# EAGLE design initial-commit-01 (EAGLE 9.2.2)
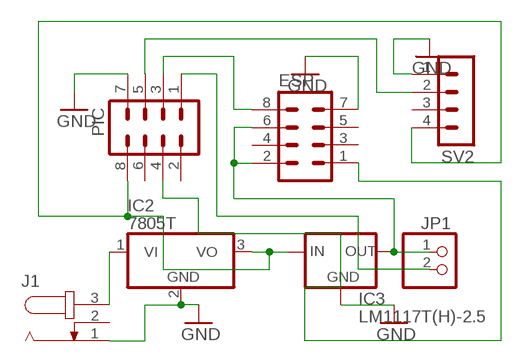
[diagram p0: schematic, sheet 1]

## Parts
ESP  MA04-2  [MA04-2]
IC2  7805T  [TO220H]
IC3  LM1117T(H)-2.5  [TO220H]
J1  JACK-PLUG1  [SPC4078]
JP1  PINHD-1X2  [1X02]
PIC  MA04-2  [MA04-2]
SV2  MA04-1  [MA04-1]

## Nets
GND: ESP.7 IC2.2(GND) IC3.1(GND) J1.1 PIC.7 SV2.1
N$1: IC2.1(VI) J1.3
N$2: ESP.1 PIC.4
N$4: ESP.2 ESP.6 IC3.2(OUT) JP1.1
N$5: ESP.8 PIC.3
N$7: JP1.2 PIC.1
N$8: PIC.5 SV2.2
N$9: IC2.3(VO) IC3.3(IN) PIC.8 SV2.4
Unconnected: ESP.3 ESP.4 ESP.5 J1.2 PIC.2 PIC.6 SV2.3

## Library data of the parts
ESP PIC = con-lstb:MA04-2: PIN HEADER; OC_FARNELL: unknown; OC_NEWARK: unknown
IC2 = linear:78*: Positive VOLTAGE REGULATOR Source: http://cache.national.com/ds/LM/LM78L05.pdf http://www.fairchildsemi.com/ds/LM/LM7805.pdf
IC3 = lm1117_10:LM1117?-*: 800mA Low-Dropout Linear Regulator Source: http://www.ti.com/lit/ds/symlink/lm1117-n.pdf; MF: Texas Instruments; MPN: LM1117T-2.5; OC_FARNELL: 1798354; OC_NEWARK: 75R2090
J1 = con-jack:JACK-PLUG: DC POWER JACK Power Jack, DC, Right Angle, Through Hole, Rated 5A at 16VDC, PC Terminals Distributor: Farnell (www.Farnell.de) Drawing: 84N1161.pdf / 84N1162.pdf Manufacturer: SPC Technology (www.spctechnology.com) Type: SPC4077 / SPC 4078; OC_FARNELL: unknown; OC_NEWARK: unknown
JP1 = pinhead:PINHD-1X2: PIN HEADER
SV2 = con-lstb:MA04-1: PIN HEADER; OC_FARNELL: unknown; OC_NEWARK: unknown

## Net classes
0 default: width 0.254 mm, clearance 0.254 mm

## Board
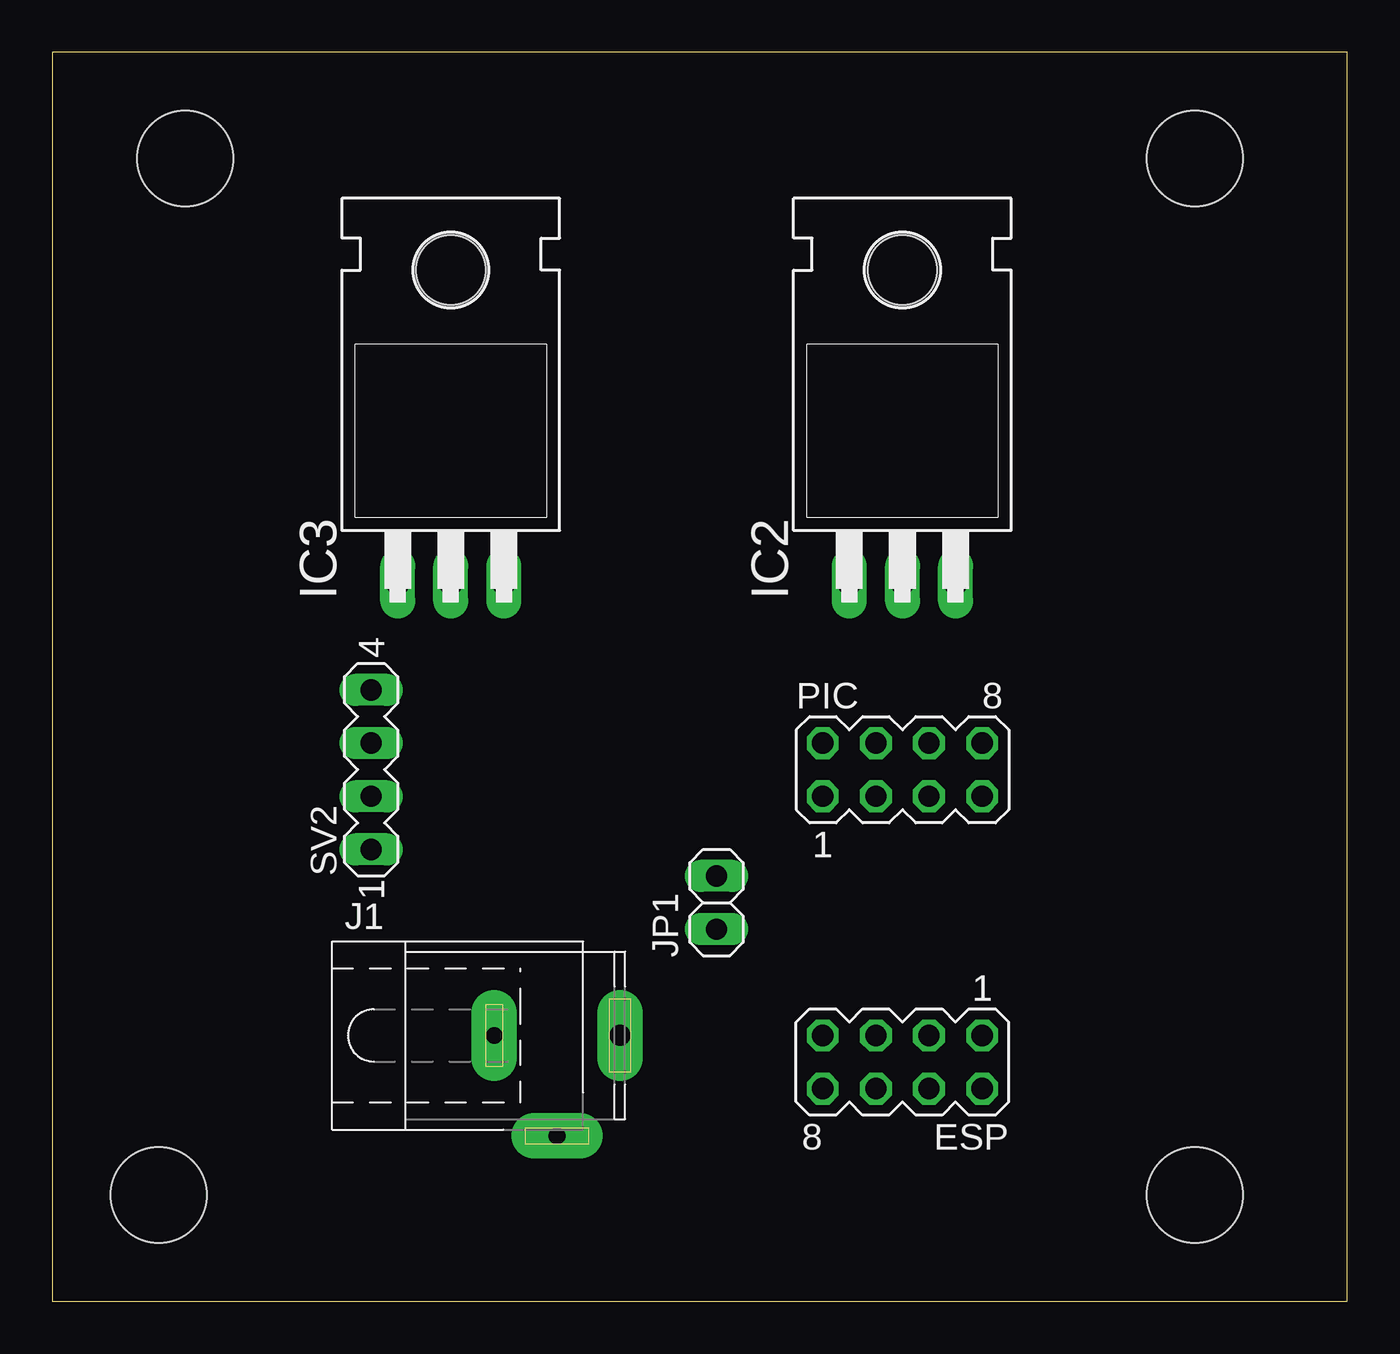
[diagram p1: board, top side]
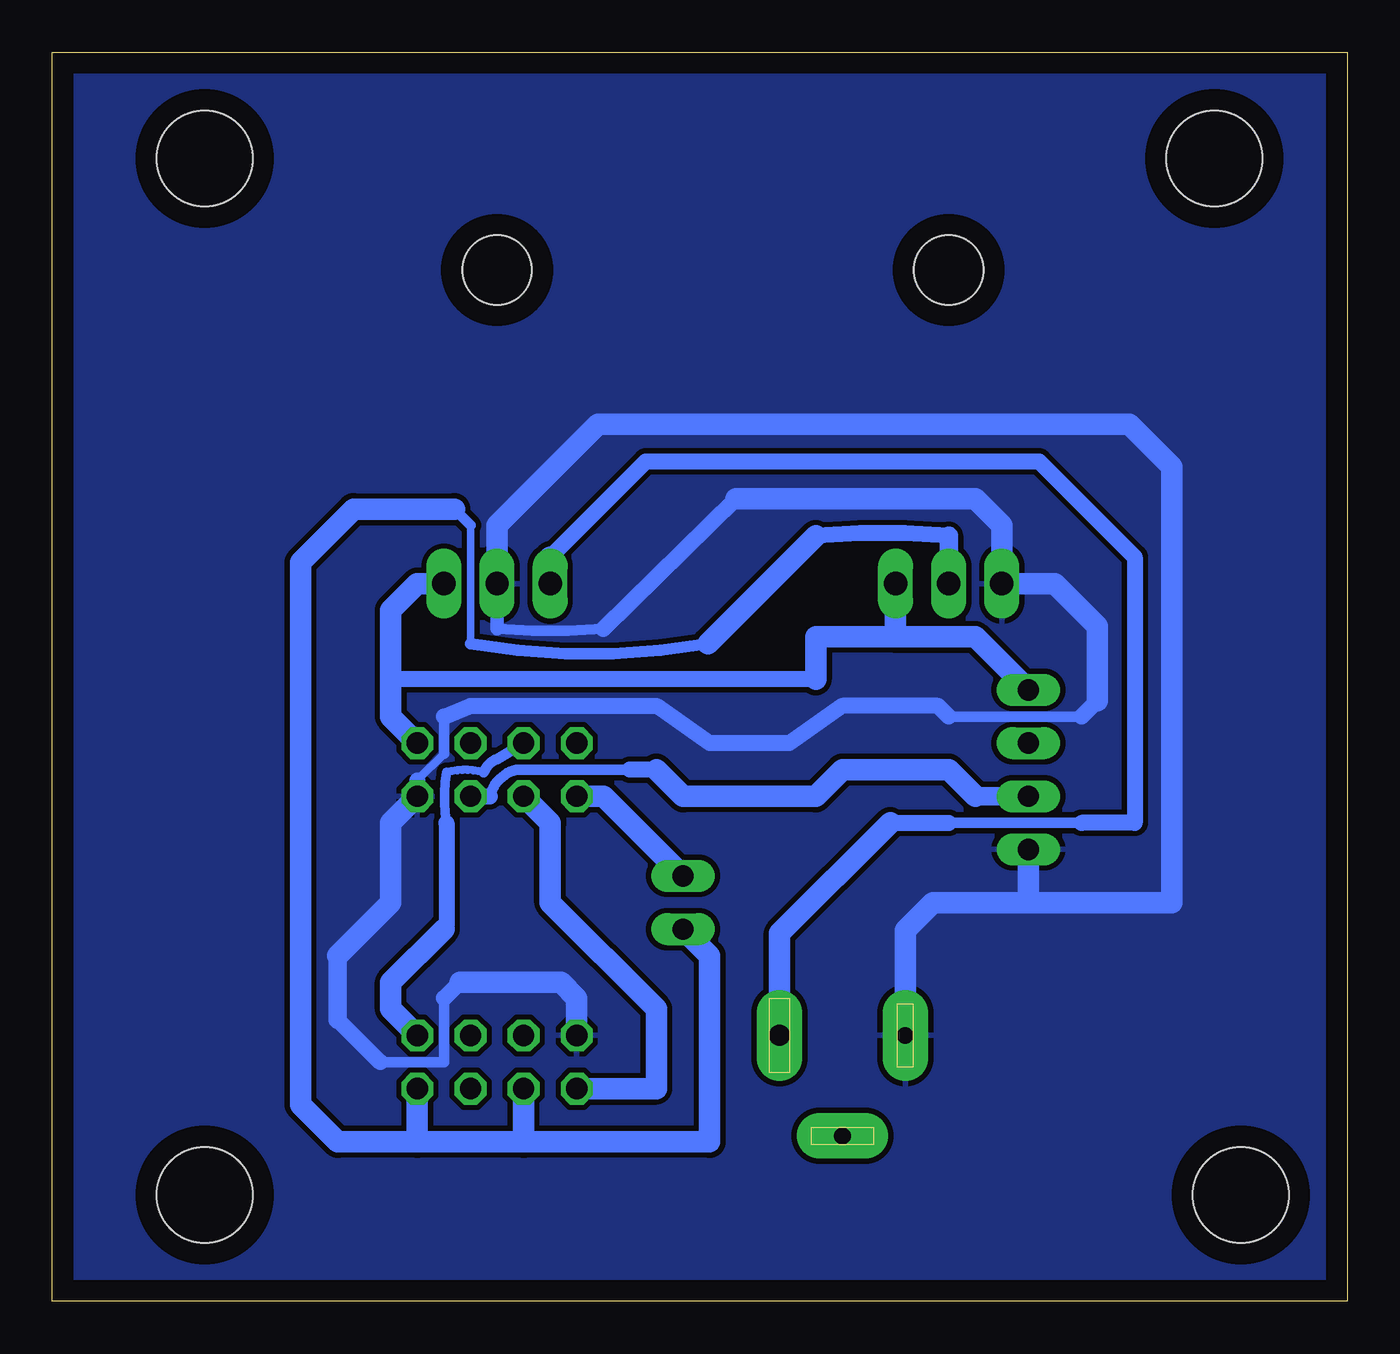
[diagram p2: board, bottom side, seen from below]

Size 61.9 x 59.68 mm. Coordinates in mm from the lower left corner, seen from the top.
Outline: 0,0 61.9,0 61.9,59.68 0,59.68 0,0
Copper layers (1*16): Top 0.035mm / dielectric 1.5mm / Bottom 0.035mm
Design rules "default": minimum track width 6mil, minimum drill 0.35mm, track to track 6mil, track to pad 6mil, pad to pad 6mil, via to via 6mil, smd to smd 6mil, copper to edge 40mil, drill to drill 6mil, minimum pad ring 10mil, minimum via ring 8mil, stop-mask expansion 4mil, vias tented up to drill 0mil, thermal gap 10mil
Holes 4.57 mm at 5.08,5.08 54.61,5.08 6.35,54.61 54.61,54.61

### Footprints (pad centres in the part's own frame; a part is rotated, then mirrored left to right if it is on the bottom)
MA04-2 = drill 1.016 octagon: 1 -3.81,-1.27; 2 -3.81,1.27; 3 -1.27,-1.27; 4 -1.27,1.27; 5 1.27,-1.27; 6 1.27,1.27; 7 3.81,-1.27; 8 3.81,1.27
TO220H = drill 1.118 long: 1 -2.54,-10.16; 2 0,-10.16; 3 2.54,-10.16 | hole 3.302: 0,4.826
SPC4078 = drill 0.8 pad 2.184 long: 1 -3,0; 2 0,-4.8 | drill 1 pad 2.184 long: 3 3,0
1X02 = drill 1.016 long: 1 -1.27,0; 2 1.27,0
MA04-1 = drill 1.016 long: 1 -3.81,0; 2 -1.27,0; 3 1.27,0; 4 3.81,0

### Placement (x,y rotation side)
ESP  40.64,11.43 180 top
IC2  40.64,44.45 0 top
IC3  19.05,44.45 0 top
J1  24.13,12.7 0 top
JP1  31.75,19.05 90 top
PIC  40.64,25.4 0 top
SV2  15.24,25.4 90 top

### Tracks (layer width: path | path; a pad name or v marks a point on that pad's centre or on a via)
GND
  Bottom 0.381: 43.18,26.16 44.45,24.89
  Bottom 0.508: 43.18,14.48 43.18,11.43 46.23,11.43 | 43.18,26.16 43.18,27.94 | 12.7,27.94 19.05,27.94 | 40.64,32.13 arc-10 35.56,32.13
  Bottom 0.635: 40.64,32.13 IC2.2
  Bottom 0.762: 43.18,14.48 42.42,15.24 | 44.45,24.89 PIC.7 | 19.05,27.94 19.56,28.45 24.13,28.45 26.67,26.67 30.48,26.67 33.02,28.45 41.91,28.45 43.18,27.94 | 11.94,28.7 12.7,27.94 | 46.23,11.43 48.26,13.46 | 35.56,32.13 29.21,38.35
  Bottom 0.889: 48.26,13.46 48.26,16.51
  Bottom 1.016: ESP.7 36.83,14.48 37.59,15.24 42.42,15.24 | 48.26,16.51 45.72,19.05 45.72,22.86 PIC.7 | J1.1 21.13,17.73 19.81,19.05 15.24,19.05 | 29.21,38.35 17.78,38.35 16.51,37.08 IC3.1 13.97,34.29 11.94,32.26 11.94,28.7 | 15.24,19.05 SV2.1 | IC2.2 40.64,37.08 35.81,41.91 10.41,41.91 8.38,39.88 8.38,19.05 15.24,19.05
  pour Bottom: 0,59.69 62.23,59.69 62.23,0 0,0
N$1
  Bottom 0.508: 12.7,22.86 19.05,22.86
  Bottom 0.762: 38.1,35.56 33.53,40.13 14.73,40.13 10.16,35.56 10.16,22.86 12.7,22.86 | 21.84,22.86 19.05,22.86
  Bottom 1.016: 38.1,35.56 IC2.1 | J1.3 27.13,17.57 21.84,22.86
N$2
  Bottom 0.254: 43.05,17.91 43.18,17.78
  Bottom 0.381: 41.27,25.27 arc-30 43.05,25.27
  Bottom 0.457: 43.05,25.27 arc-20 43.05,22.86
  Bottom 0.508: 41.27,25.27 arc50 40.64,25.91 PIC.4
  Bottom 0.762: 43.05,22.86 43.05,17.91
  Bottom 1.016: ESP.1 45.72,13.97 45.72,15.24 43.18,17.78
N$4
  Bottom 0.356: 41.91,37.08 41.91,31.42
  Bottom 0.508: 42.67,37.85 41.91,37.08
  Bottom 0.559: 41.91,31.42 arc-20 30.56,31.42
  Bottom 0.762: 19.05,36.58 arc-10 25.4,36.58
  Bottom 0.889: 19.05,36.58 IC3.2
  Bottom 1.016: 42.67,37.85 47.5,37.85 50.04,35.31 50.04,9.4 48.26,7.62 44.45,7.62 | 39.37,7.62 30.48,7.62 30.48,16.51 JP1.1 | 39.37,7.62 ESP.6 | ESP.2 44.45,7.62 | 39.37,7.62 44.45,7.62 | 25.4,36.58 30.56,31.42
N$5
  Bottom 1.016: PIC.3 38.1,22.86 38.1,19.05 33.02,13.97 33.02,10.16 ESP.8
N$7
  Bottom 1.016: PIC.1 35.56,24.13 JP1.2
N$8
  Bottom 0.508: 40.99,24.13 arc60 39.72,25.4 34.29,25.4
  Bottom 0.762: 33.02,25.4 34.29,25.4 | PIC.5 40.99,24.13
  Bottom 0.889: SV2.2 17.78,24.13
  Bottom 1.016: 17.78,24.13 19.05,25.4 24.13,25.4 25.4,24.13 31.75,24.13 33.02,25.4
N$9
  Bottom 0.762: 25.4,29.72 45.72,29.72
  Bottom 1.016: PIC.8 45.72,27.94 45.72,29.72 45.72,33.02 44.45,34.29 IC2.3 | IC3.3 21.59,31.75 | 21.59,31.75 25.4,31.75 25.4,29.72 | 21.59,31.75 17.78,31.75 SV2.4